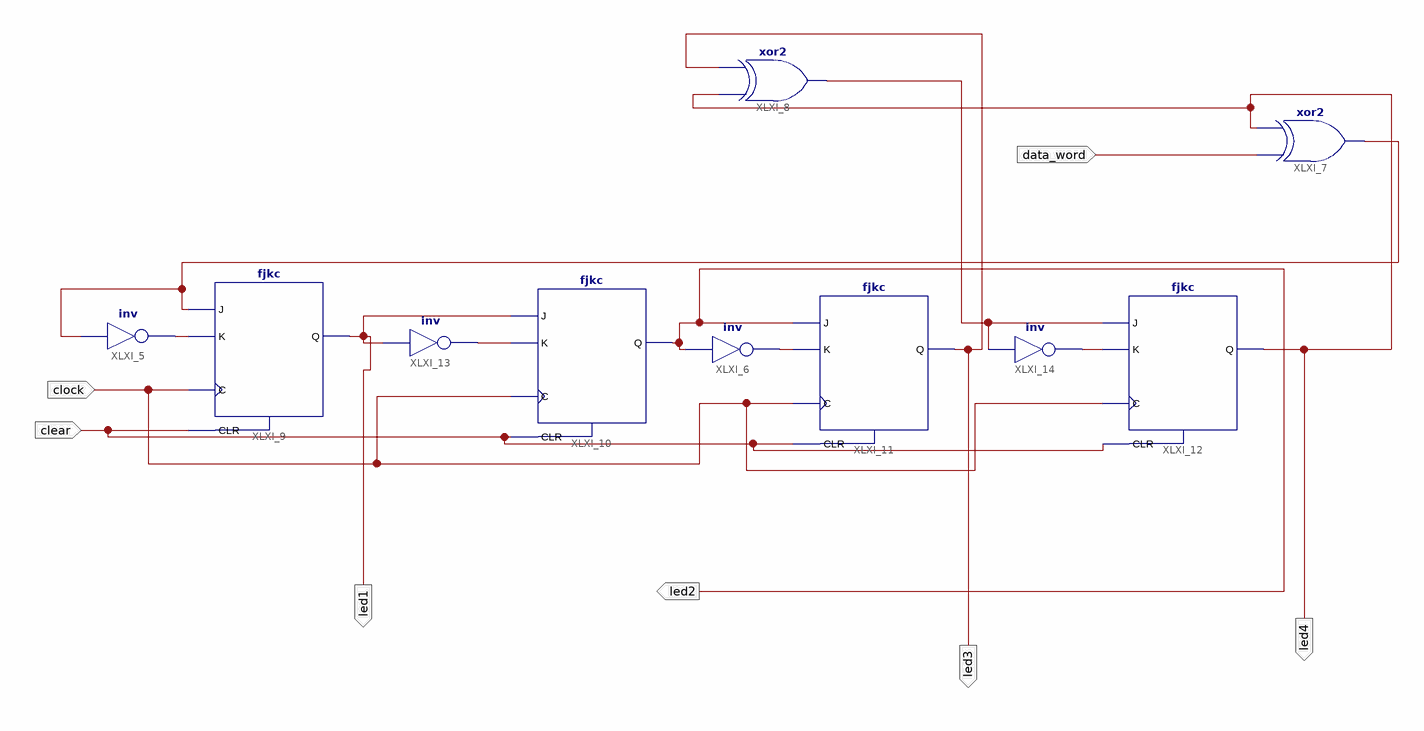
[diagram p0: schematic sheet 1]
// Xilinx ISE schematic CRC.sch (spartan6) as structural Verilog: 10 symbols, 7 ports
module CRC (
  input  data_word,
  input  clock,
  input  clear,
  output led1,
  output led4,
  output led2,
  output led3
);

  wire XLXN_10, XLXN_13, XLXN_23, XLXN_24, XLXN_36, XLXN_52;

  not XLXI_5 (XLXN_10, XLXN_36);
  not XLXI_6 (XLXN_23, led2);
  xor XLXI_7 (XLXN_36, data_word, led4);
  xor XLXI_8 (XLXN_52, led4, led3);
  fjkc XLXI_9 (.C(clock), .CLR(clear), .J(XLXN_36), .K(XLXN_10), .Q(led1));
  fjkc XLXI_10 (.C(clock), .CLR(clear), .J(led1), .K(XLXN_13), .Q(led2));
  fjkc XLXI_12 (.C(clock), .CLR(clear), .J(XLXN_52), .K(XLXN_24), .Q(led4));
  not XLXI_13 (XLXN_13, led1);
  not XLXI_14 (XLXN_24, XLXN_52);
  fjkc XLXI_11 (.C(clock), .CLR(clear), .J(led2), .K(XLXN_23), .Q(led3));
endmodule
